# Altium schematic sheet UBC-Thunderbots_PCB_Power__archive_power-v2.2_pcb__power-v2.2.SchDoc
size A4
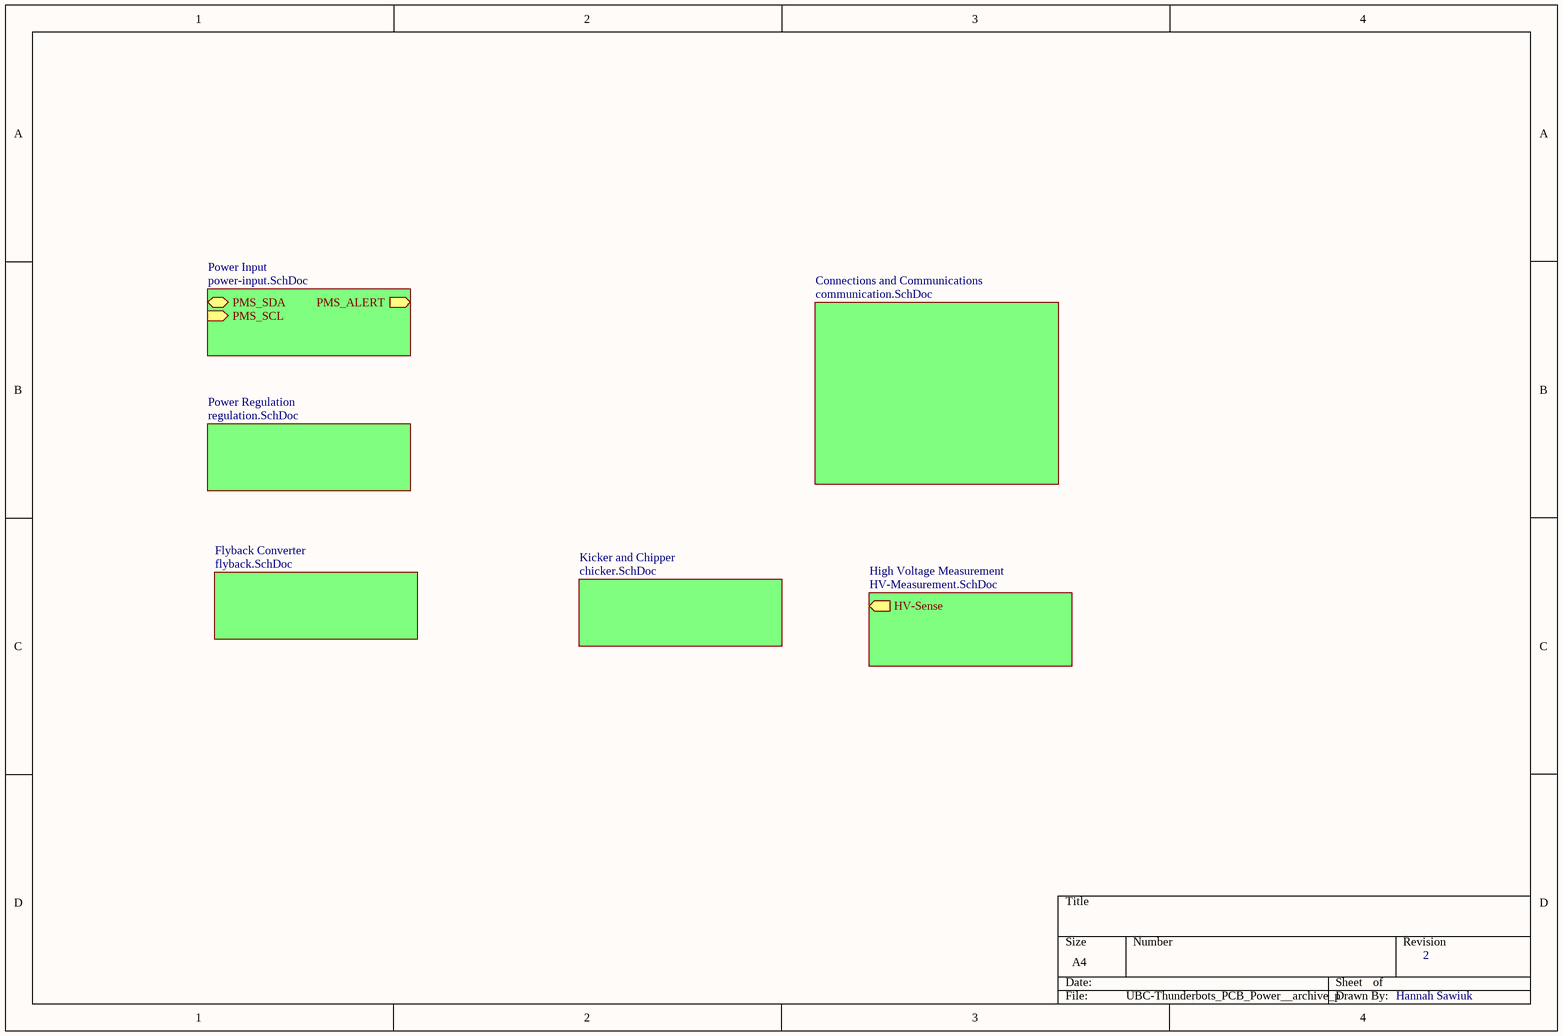
[diagram p0: UBC-Thunderbots_PCB_Power__archive_power-v2.2_pcb__power-v2.2.SchDoc]

## Sub-sheets
Connections and Communications = communication.SchDoc: no entries
Flyback Converter = flyback.SchDoc: no entries
High Voltage Measurement = HV-Measurement.SchDoc: HV-Sense (out)
Kicker and Chipper = chicker.SchDoc: no entries
Power Input = power-input.SchDoc: PMS_SDA (bidir), PMS_SCL (in), PMS_ALERT (out)
Power Regulation = regulation.SchDoc: no entries

## Notes on the sheet
- 2
- Hannah Sawiuk